# EAGLE design scanlab_d-sub_extension_v4 (EAGLE 5.09)
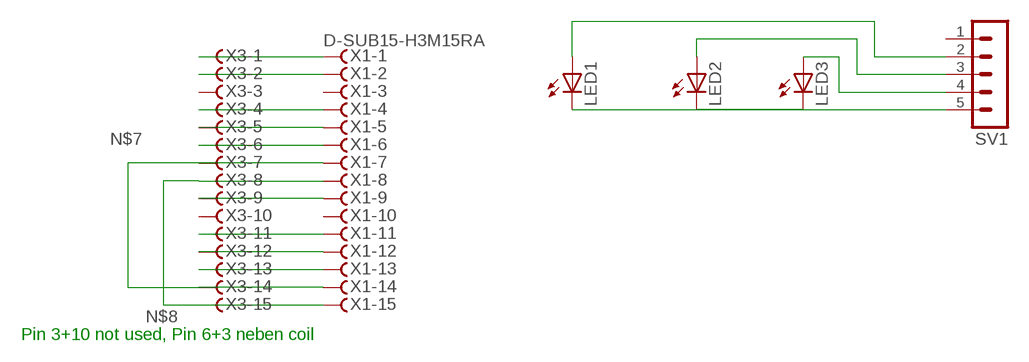
[diagram p0: schematic, sheet 1]

## Parts
LED1  LED3MM  [LED3MM]
LED2  LED3MM  [LED3MM]
LED3  LED3MM  [LED3MM]
SV1  MA05-1  [MA05-1]
X1  D-SUB15-H3M15RA  [H3M15RA]
X3  F15DS  [F15D]

## Nets
N$1: X1.1 X3.1
N$2: X1.2 X3.2
N$3: LED1.K(C) LED2.K(C) LED3.K(C) SV1.5
N$4: X1.4 X3.4
N$5: X1.5 X3.5
N$6 [pin 6+13 neben coil]: X1.6 X3.6
N$7 [breit]: X1.7 X1.14 X3.7 X3.14
N$8 [breit]: X1.8 X1.15 X3.8 X3.15
N$9: X1.9 X3.9
N$10: LED3.A SV1.4
N$11: X1.11 X3.11
N$12: X1.12 X3.12
N$13 [pin 6+13 neben coil]: X1.13 X3.13
N$14: LED2.A SV1.3
N$15: LED1.A SV1.2
Unconnected: SV1.1 X1.3 X1.10 X3.3 X3.10

## Notes on the sheet
- Pin 3+10 not used, Pin 6+3 neben coil

## Library data of the parts
LED1-LED3 = led:LED: LED OSRAM: - CHIPLED LG R971, LG N971, LY N971, LG Q971, LY Q971, LO R971, LY R971 LH N974, LH R974 LS Q976, LO Q976, LY Q976 LO Q996 - Hyper CHIPLED LW Q18S LB Q993, LB Q99A, LB R99A - SideLED LS A670, LO A670, LY A670, LG A670, LP A670 LB A673, LV A673, LT A673, LW A673 LH A674 LY A675 LS A676, LA A676, LO A676, LY A676, LW A676 LS A679, LY A679, LG A679 - Hyper Micro SIDELED® LS Y876, LA Y876, LO Y876, LY Y876 LT Y87S - SmartLED LW L88C, LW L88S LB L89C, LB L89S, LG L890 LS L89K, LO L89K, LY L89K LS L896, LA L896, LO L896, LY L896 - TOPLED LS T670, LO T670, LY T670, LG T670, LP T670 LSG T670, LSP T670, LSY T670, LOP T670, LYG T670 LG T671, LOG T671, LSG T671 LB T673, LV T673, LT T673, LW T673 LH T674 LS T676, LA T676, LO T676, LY T676, LB T676, LH T676, LSB T676, LW T676 LB T67C, LV T67C, LT T67C, LS T67K, LO T67K, LY T67K, LW E67C LS E67B, LA E67B, LO E67B, LY E67B, LB E67C, LV E67C, LT E67C LW T67C LS T679, LY T679, LG T679 LS T770, LO T770, LY T770, LG T770, LP T770 LB T773, LV T773, LT T773, LW T773 LH T774 LS E675, LA E675, LY E675, LS T675 LS T776, LA T776, LO T776, LY T776, LB T776 LHGB T686 LT T68C, LB T68C - Hyper Mini TOPLED® LB M676 - Mini TOPLED Santana® LG M470 LS M47K, LO M47K, LY M47K Source: http://www.osram.convergy.de LUXEON: - LUMILED® LXK2-PW12-R00, LXK2-PW12-S00, LXK2-PW14-U00, LXK2-PW14-V00 LXK2-PM12-R00, LXK2-PM12-S00, LXK2-PM14-U00 LXK2-PE12-Q00, LXK2-PE12-R00, LXK2-PE12-S00, LXK2-PE14-T00, LXK2-PE14-U00 LXK2-PB12-K00, LXK2-PB12-L00, LXK2-PB12-M00, LXK2-PB14-N00, LXK2-PB14-P00, LXK2-PB14-Q00 LXK2-PR12-L00, LXK2-PR12-M00, LXK2-PR14-Q00, LXK2-PR14-R00 LXK2-PD12-Q00, LXK2-PD12-R00, LXK2-PD12-S00 LXK2-PH12-R00, LXK2-PH12-S00 LXK2-PL12-P00, LXK2-PL12-Q00, LXK2-PL12-R00 Source: www.luxeon.com KINGBRIGHT: KA-3528ASYC Source: www.kingbright.com
SV1 = con-lstb:MA05-1: PIN HEADER
X1 = con-thomas-betts:D-SUB15-: D-Subminiatur Connector Source: Electronioc Interconnects European Edition 1998
X3 = con-subd:F15?S: SUB-D

## Net classes
1 breit: width 1.27 mm
2 pin 6+13 neben coil: width 1.27 mm

## Board
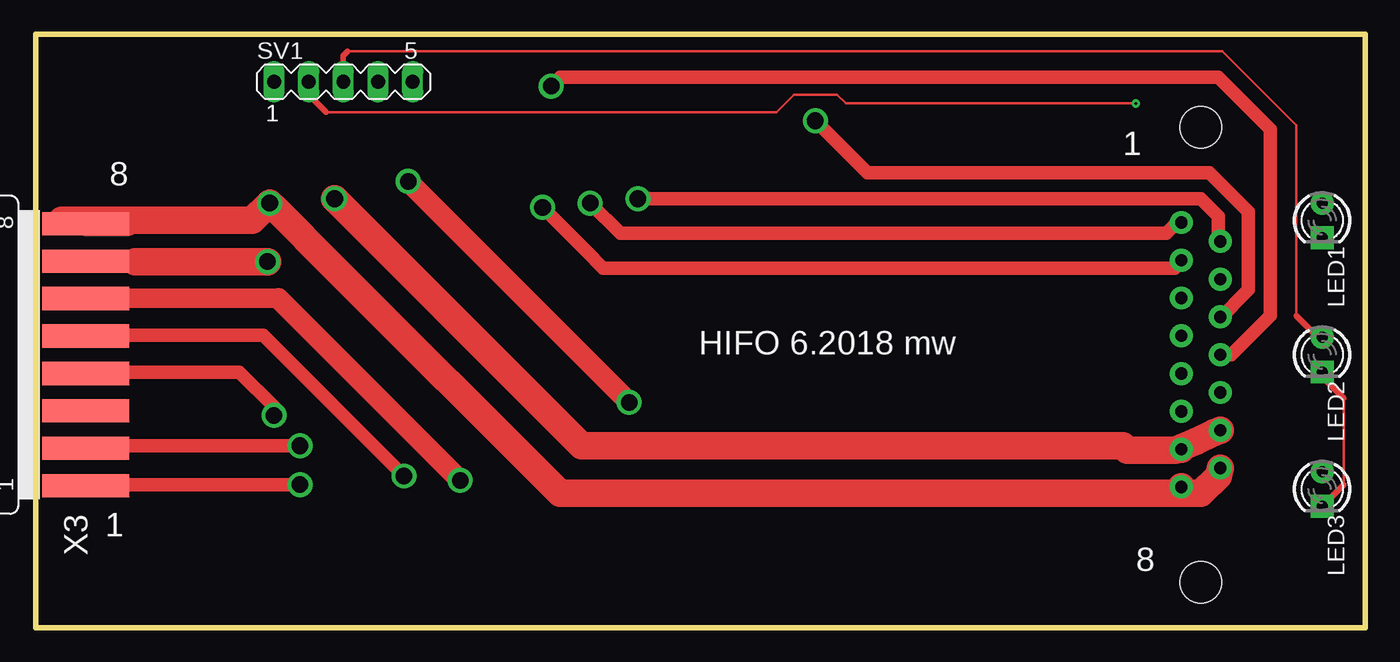
[diagram p1: board, top side]
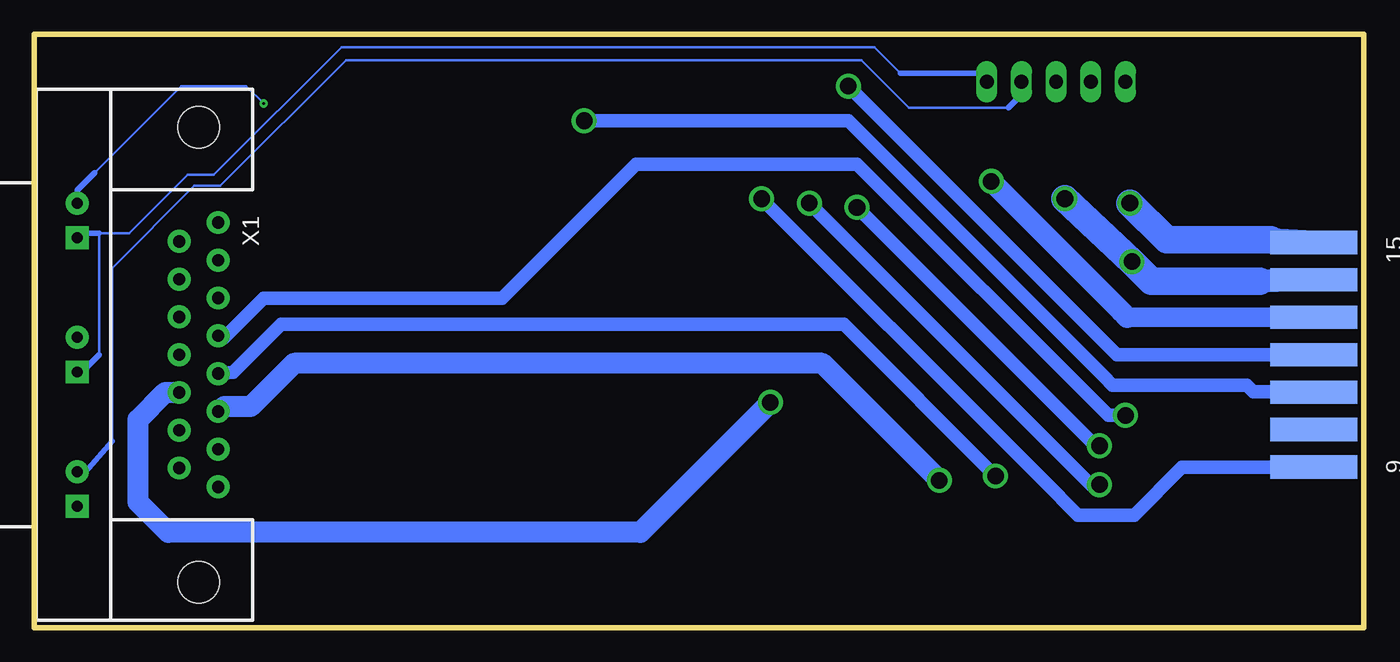
[diagram p2: board, bottom side, seen from below]

Size 97.47 x 43.5 mm. Coordinates in mm from the lower left corner, seen from the top.
Outline: 0,0 97.45,0
Outline: 97.45,0 97.47,0
Outline: 97.47,0 97.45,0
Outline: 97.45,0 97.47,0
Outline: 97.47,0 97.45,0
Outline: 97.45,0 97.45,43.49 0,43.49
Outline: 0,43.49 0,43.5
Outline: 0,43.5 0,43.49
Outline: 0,43.49 0,43.5
Outline: 0,43.5 0,43.49
Outline: 0,43.49 0,0
Outline: 0,0 97.45,0
Outline: 97.45,0 97.47,0
Outline: 97.47,0 97.45,0
Outline: 97.45,0 97.47,0
Outline: 97.47,0 97.47,43.5 0,43.5
Outline: 0,43.5 0,43.49
Outline: 0,43.49 0,43.5
Outline: 0,43.5 0,43.49
Outline: 0,43.49 0,0
Copper layers (1*16): Top 0.035mm / dielectric 1.55mm / Bottom 0.035mm
Design rules "Multi-CB_2L_200Âµm-Tracks_OL70Âµm": minimum track width 0.2mm, minimum drill 0.2mm, track to track 0.2mm, track to pad 0.2mm, pad to pad 0.2mm, via to via 0.2mm, smd to smd 0mil, copper to edge 0.2mm, drill to drill 0.2mm, minimum pad ring 0.2mm, minimum via ring 0.2mm, stop-mask expansion 2mil, vias tented up to drill 0.45mm, thermal gap 0.2mm

### Footprints (pad centres in the part's own frame; a part is rotated, then mirrored left to right if it is on the bottom)
LED3MM = drill 0.8 pad 1.676 round: A -1.27,0 | drill 0.8 pad 1.676 square: K 1.27,0
MA05-1 = drill 1.016 long: 1 -5.08,0; 2 -2.54,0; 3 0,0; 4 2.54,0; 5 5.08,0
H3M15RA = drill 0.9 pad 1.676 round: 1 -9.69,1.422; 2 -6.921,1.422; 3 -4.153,1.422; 4 -1.384,1.422; 5 1.384,1.422; 6 4.153,1.422; 7 6.921,1.422; 8 9.69,1.422; 9 -8.306,-1.422; 10 -5.537,-1.422; 11 -2.769,-1.422; 12 0,-1.422; 13 2.769,-1.422; 14 5.537,-1.422; 15 8.306,-1.422 | hole 3.048: -16.662,0; 16.662,0
F15D = smd 1.7 x 6.35: 1 -9.601,-7.468; 2 -6.858,-7.468; 3 -4.115,-7.468; 4 -1.372,-7.468; 5 1.372,-7.468; 6 4.115,-7.468; 7 6.858,-7.468; 8 9.601,-7.468 | smd 1.7 x 6.35 bottom: 9 -8.23,-7.468; 10 -5.486,-7.468; 11 -2.743,-7.468; 12 0,-7.468; 13 2.743,-7.468; 14 5.486,-7.468; 15 8.23,-7.468

### Placement (x,y rotation side)
LED1  94.3,29.84 270 top
LED2  94.3,20 270 top
LED3  94.3,10.16 270 top
SV1  22.54,40.01 0 top
X1  85.41,20 270 bottom
X3  -3.81,20 90 top

### Tracks (layer width: path | path; a pad name or v marks a point on that pad's centre or on a via)
N$1  (via drill 1.22)
  Top 0.991: v40.64,31.12 42.86,28.89 80.96,28.89 82.87,28.89 83.67,29.69 X1.1 | v19.37,10.48 2.54,10.48 X3.1
  Bottom 0.991: v19.37,10.48 19.05,10.48 20,10.48 v40.64,31.12
N$2  (via drill 1.22)
  Top 0.991: v37.15,30.8 40.32,27.62 41.59,26.35 83.5,26.35 X1.2 | v19.37,13.34 2.22,13.34 X3.2
  Bottom 0.991: v19.37,13.34 19.68,13.34 20,13.65 v37.15,30.8
N$3
  Top 0.2: 95.88,16.83 95.88,10.48 | LED2.K 93.98,18.73 | LED3.K 93.98,8.57 LED3.K
  Top 0.406: 95.88,10.48 LED3.K | 93.98,18.73 95.88,16.83
  Bottom 0.2: 33.97,40.64 35.88,42.55 74.93,42.55 84.3,33.18 86.2,33.18 90.49,28.89 92.71,28.89 92.71,20 | SV1.5 27.62,40.64 | 93.98,18.73 LED2.K 93.98,18.73
  Bottom 0.406: 27.62,40.64 33.97,40.64 | 92.71,28.89 93.98,28.89 LED1.K | 92.71,20 93.98,18.73 LED2.K
N$4  (via drill 1.22)
  Top 0.991: v17.46,15.56 17.46,16.19 14.92,18.73 3.81,18.73 2.54,18.73 X3.4
  Bottom 0.991: v17.46,15.56 18.73,15.56 37.15,33.97 53.34,33.97 63.18,24.13 80.65,24.13 83.5,21.27 X1.4
N$5  (via drill 1.22)
  Top 0.991: v26.99,11.11 16.67,21.43 2.38,21.43 X3.5
  Bottom 0.991: v26.99,11.11 38.1,22.22 79.38,22.22 82.87,18.73 X1.5
N$6  (via drill 1.22)
  Top 1.422: 2.22,24.13 17.78,24.13
  Top 1.524: 17.78,24.13 v31.12,10.79 | X3.6 2.22,24.13
  Bottom 1.524: v31.12,10.79 39.69,19.37 78.42,19.37 81.6,16.19 83.5,16.19 X1.6
N$7  (via drill 1.22)
  Top 1.676: 7.3,26.83 X3.7
  Top 2.032: 83.5,13.02 85.09,13.65 86.36,14.29 X1.14 | 83.5,13.02 X1.7 83.5,13.02 | v16.99,26.83 7.3,26.83 | 83.5,13.02 80.01,13.02 79.69,13.34 40.01,13.34 25.72,27.62 v21.91,31.43
  Bottom 1.676: X3.14 7.62,25.4
  Bottom 2.032: 7.62,25.4 15.56,25.4 v16.99,26.83 v21.91,31.43
N$8  (via drill 1.22)
  Top 1.778: 1.91,29.84 6.74,29.6 X3.8
  Top 2.032: 84.14,9.84 85.41,9.84 86.68,11.11 X1.15 | 84.14,9.84 X1.8 84.14,9.84 | 1.91,29.84 15.88,29.84 v17.14,31.12 17.46,30.8 21.91,26.35 38.42,9.84 84.14,9.84
  Bottom 1.676: X3.15 6.83,28.42
  Bottom 2.032: v17.14,31.12 14.45,28.42 6.83,28.42
N$9  (via drill 1.22)
  Top 0.991: v44.13,31.43 85.41,31.43 86.68,30.16 86.68,28.89 X1.9
  Bottom 0.991: v44.13,31.43 25.4,12.7 23.49,10.79 20.95,8.25 16.83,8.25 13.34,11.75 X3.9
N$10
  Bottom 0.2: 26.04,38.1 33.34,38.1 36.83,41.59 74.61,41.59 83.82,32.38 85.72,32.38 91.76,26.35 91.76,13.65
  Bottom 0.406: 26.04,38.1 25.08,39.05 SV1.4 | 91.76,13.65 93.98,11.11 LED3.A
N$11  (via drill 1.22)
  Top 0.991: v57.15,37.15 60.96,33.34 86.04,33.34 88.9,30.48 88.9,24.77 86.68,22.54 X1.11
  Bottom 0.991: v57.15,37.15 37.78,37.15 36.83,36.2 19.05,18.41 18.41,17.78 8.57,17.78 8.1,17.3 5.24,17.3 5.19,17.26 X3.11
N$12  (via drill 1.22)
  Top 0.991: v37.78,39.69 38.42,40.32 86.68,40.32 90.49,36.51 90.49,22.86 87.63,20 X1.12
  Bottom 0.991: v37.78,39.69 18.1,20 2.54,20 X3.12
N$13  (via drill 1.22)
  Top 1.524: v27.3,32.7 v43.5,16.51
  Bottom 1.422: X3.13 17.35,22.75
  Bottom 1.524: X1.13 87.86,17.23 89.85,15.24 89.85,9.21 87.63,6.99 53.02,6.99 v43.5,16.51 | v27.3,32.7 17.78,23.18 17.35,22.75
N$14
  Top 0.2: 22.86,42.23 87,42.23 92.39,36.83 92.39,22.86
  Top 0.406: 22.86,42.23 22.54,41.91 SV1.3 | 92.39,22.86 93.98,21.27 LED2.A
N$15  (via drill 0.2)
  Top 0.2: 21.27,37.78 54.29,37.78 55.56,39.05 58.74,39.05 59.37,38.42 v80.65,38.42
  Top 0.406: 21.27,37.78 20,39.05 SV1.2
  Bottom 0.2: v80.65,38.42 81.91,39.69 86.68,39.69 93.03,33.34
  Bottom 0.406: 93.03,33.34 94.3,32.07 LED1.A

### Text on the board
tPlace: 1 | 8 | HIFO 6.2018 mw | 1 | 8
Document: 8+15 und 7+14 verbunden, 3+10 ungebraucht